# Altium schematic sheet SW8-AcousticsPowerBoard.SchDoc
size A; SheetNumber: 1; SheetTotal: 1
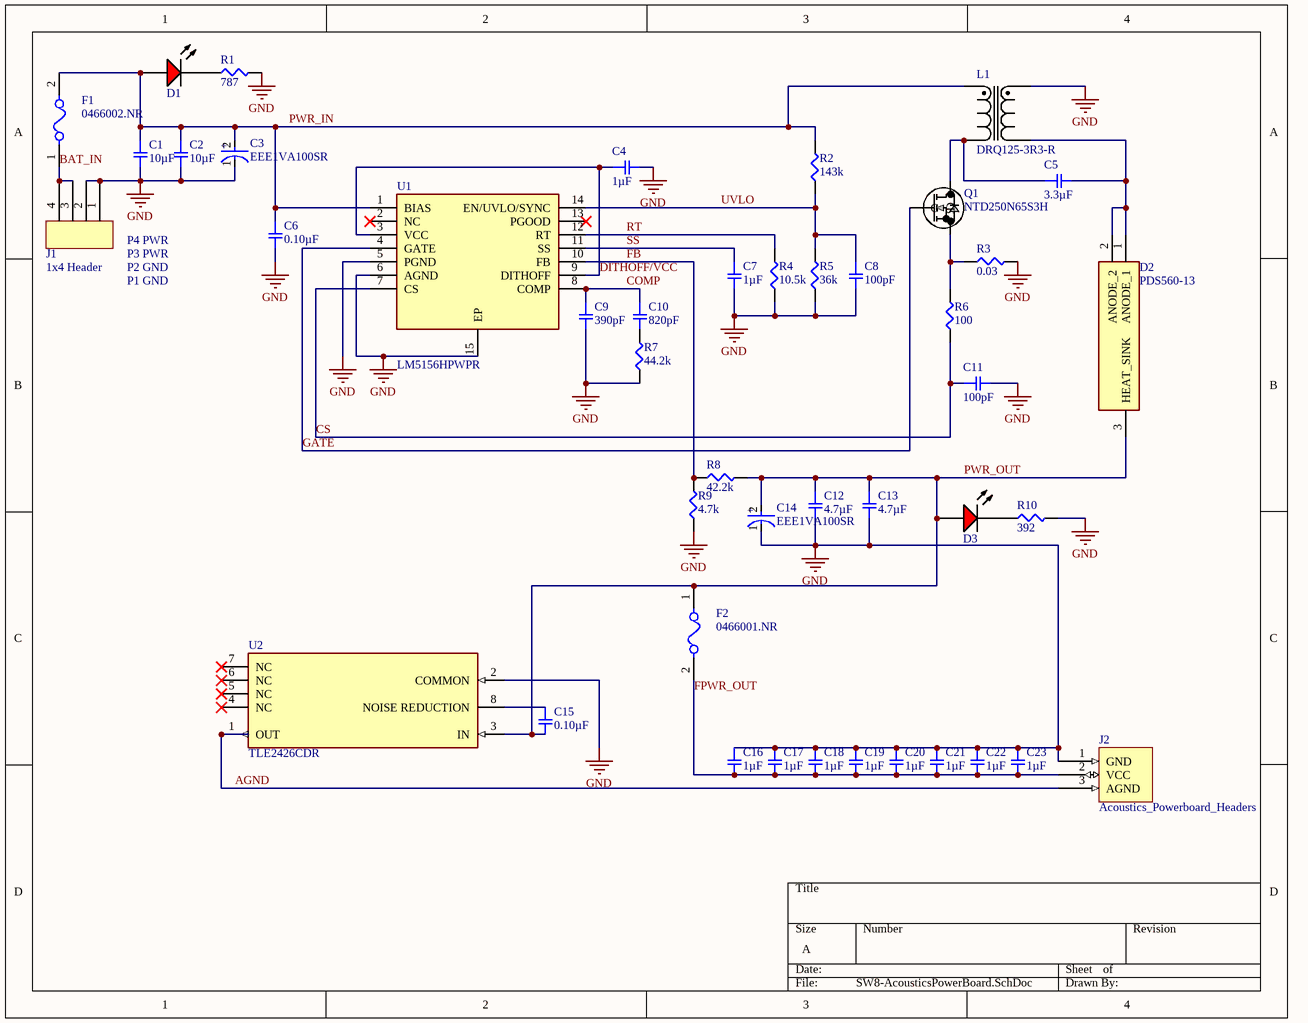
[diagram p0: SW8-AcousticsPowerBoard.SchDoc]

## Parts
C1  10µF  [SMD-0805C]
C2  10µF  [SMD-0805C]
C3  EEE1VA100SR  [FP-SC-MFG]
C4  1µF  [SMD-0805C]
C5  3.3µF  [SMD-0805C]
C6  0.10µF  [SMD-0805C]
C7  1µF  [SMD-0805C]
C8  100pF  [SMD-0805C]
C9  390pF  [SMD-0805C]
C10  820pF  [SMD-0805C]
C11  100pF  [SMD-0805C]
C12  4.7µF  [SMD-0805C]
C13  4.7µF  [SMD-0805C]
C14  EEE1VA100SR  [FP-SC-MFG]
C15  0.10µF  [SMD-0805C]
C16  1µF  [SMD-0805C]
C17  1µF  [SMD-0805C]
C18  1µF  [SMD-0805C]
C19  1µF  [SMD-0805C]
C20  1µF  [SMD-0805C]
C21  1µF  [SMD-0805C]
C22  1µF  [SMD-0805C]
C23  1µF  [SMD-0805C]
D1  TLMS1100-GS08  [VISH-TLMX1100_V]  (value not drawn)
D2  PDS560-13  [POWERDI5]
D3  TLMS1100-GS08  [VISH-TLMX1100_V]  (value not drawn)
F1  0466002.NR  [FP-0466-MFG]
F2  0466001.NR  [FP-0466-MFG]
J1  1x4 Header  [1X4 HEADER]
J2  Acoustics_Powerboard_Headers  [Acoustics_Powerboard_Headers]
L1  DRQ125-3R3-R  [DRQ125]
Q1  NTD250N65S3H  [TO252_NTD250_ONS]
R1  787  [SMD-0805-RES]
R2  143k  [SMD-0805-RES]
R3  0.03  [SMD-0805-RES]
R4  10.5k  [SMD-0805-RES]
R5  36k  [SMD-0805-RES]
R6  100  [SMD-0805-RES]
R7  44.2k  [SMD-0805-RES]
R8  42.2k  [SMD-0805-RES]
R9  4.7k  [SMD-0805-RES]
R10  392  [SMD-0805-RES]
U1  LM5156HPWPR  [SOP65P640X120-15N]
U2  TLE2426CDR  [FP-D0008A-IPC_B]

## Nets
GND: C1.2 C2.2 C3.1(C) C4.2 C6.2 C7.2 C8.2 C9.2 C11.2 C12.2 C13.2 C14.1(C) C16.1 C17.1 C18.1 C19.1 C20.1 C21.1 C22.1 C23.1 J1.1 J1.2 J2.1(GND) L1.2 R1.2 R3.2 R4.1 R5.1 R7.1 R9.1 R10.2 U1.5(PGND) U1.6(AGND) U1.15(EP) U2.2(COMMON)
AGND: J2.3(AGND) U2.1(OUT)
BAT_IN: F1.1 J1.3 J1.4
COMP: C9.1 C10.1 U1.8(COMP)
CS: C11.1 R6.1 U1.7(CS)
DITHOFF/VCC: C4.1 U1.3(VCC) U1.9(DITHOFF)
FB: R8.1 R9.2 U1.10(FB)
FPWR_OUT: C16.2 C17.2 C18.2 C19.2 C20.2 C21.2 C22.2 C23.2 F2.2 J2.2(VCC)
GATE: Q1.1(G) U1.4(GATE)
PWR_IN: C1.1 C2.1 C3.2(A) C6.1 D1.1(A) F1.2 L1.1 R2.2 U1.1(BIAS)
PWR_OUT: C12.1 C13.1 C14.2(A) C15.2 D2.3(HEAT_SINK) D3.1(A) F2.1 R8.2 U2.3(IN)
RT: R4.2 U1.12(RT)
SS: C7.1 U1.11(SS)
UVLO: C8.1 R2.1 R5.2 U1.14(EN/UVLO/SYNC)
NetC5_1: C5.1 L1.3 Q1.2(D)
NetC5_2: C5.2 D2.1(ANODE_1) D2.2(ANODE_2) L1.4
NetC10_2: C10.2 R7.2
NetC15_1: C15.1 U2.8(NOISE_REDUCTION)
NetD1_2: D1.2(K) R1.1
NetD3_2: D3.2(K) R10.1
NetQ1_3: Q1.3(S) R3.1 R6.2

Not connected (* = marked no-connect by the designer): U1 2(NC)* 13(PGOOD)*; U2 4(NC)* 5(NC)* 6(NC)* 7(NC)*

## Notes on the sheet
- (near J1) P4 PWR
- (near J1) P3 PWR
- (near J1) P2 GND
- P1 GND
- (in symbol CMP-05427-000087-1) +

## Library data of the parts
C1 C2 = GRM219R61E106KA12D: CAP CER 10UF 25V X5R 0805; Manufacturer: Murata Electronics North America; Factory Stock: 0; Unit Price (USD): 0.24; Minimum Quantity: 1; Tolerance: ±10%; Datasheets: http://www.murata.com/~/media/webrenewal/support/library/catalog/products/capacitor/mlcc/c02e.pdf; Image: //media.digikey.com/Renders/Murata%20Renders/0805%20(2012%20Metric)%20.85mm.jpg; Digi-Key Part Number: 490-7207-1-ND; Part Number: GRM219R61E106KA12D; Quantity Available: 109571; @ qty: 0; Packaging: Cut Tape (CT); Series: GRM; Part Status: Active; Value: 10µF; Voltage: 25V; Temperature Coefficient: X5R; Operating Temperature: -55°C ~ 85°C; Features: Derating Recommended; Ratings: -; Applications: General Purpose; Mounting Type: Surface Mount, MLCC; Package / Case: 0805 (2012 Metric); Size / Dimension: 0.079" L x 0.049" W (2.01mm x 1.25mm); Height - Seated (Max): -; Thickness (Max): 0.037" (0.95mm); Lead Spacing: -; Lead Style: -
C3 C14 = CMP-05427-000087-1: CAP ALUM 10UF 20% 35V SMD; Life (Hours): 2000Hour; Lead Length: 2.2mm; Ripple Current (AC): 30mA; Leakage Current: 3uA; Length: 5.5mm; Construction: Cylindrical; Diameter: 5mm; RoHS Compliant: Yes; REACH SVHC: No SVHC; Capacitance: 10uF; Max Operating Temperature: 85°C; Series: S; Case/Package: Radial; Contact Plating: Tin; Packaging: Tape and Reel; Voltage Rating: 35V; Number of Pins: 2; Height: 5.4mm; Width: 5.3mm; Voltage Rating (DC): 35V; Mount: Surface Mount; Tolerance: 20%; Lead Pitch: 1.5mm; Radiation Hardening: No; Height - Seated (Max): 0.213inch; Ripple Current: 30mA; Voltage: 35V; Package Quantity: 1; Termination: SMD/SMT; Min Operating Temperature: -40°C
C4 C7 = GCJ21BR71E105KA12L: CAP CER 1UF 25V X7R 0805; Manufacturer: Murata Electronics North America; Factory Stock: 0; Unit Price (USD): 0.36; Minimum Quantity: 1; Tolerance: ±10%; Datasheets: http://www.murata.com/~/media/webrenewal/support/library/catalog/products/capacitor/mlcc/c03e.ashx; Image: //media.digikey.com/Renders/Murata%20Renders/0805%20(2012%20Metric)%20.85mm.jpg; Digi-Key Part Number: 490-5802-1-ND; Part Number: GCJ21BR71E105KA12L; Quantity Available: 15950; @ qty: 0; Packaging: Cut Tape (CT); Series: GCJ; Part Status: Active; Value: 1µF; Voltage: 25V; Temperature Coefficient: X7R; Operating Temperature: -55°C ~ 125°C; Features: Soft Termination; Ratings: AEC-Q200; Applications: Automotive, Boardflex Sensitive; Mounting Type: Surface Mount, MLCC; Package / Case: 0805 (2012 Metric); Size / Dimension: 0.079" L x 0.049" W (2.00mm x 1.25mm); Height - Seated (Max): -; Thickness (Max): 0.057" (1.45mm); Lead Spacing: -; Lead Style: -
C5 = GRM21BR61E335KA12L: CAP CER 3.3UF 25V X5R 0805; Manufacturer: Murata Electronics North America; Factory Stock: 0; Unit Price (USD): 0.42; Minimum Quantity: 1; Tolerance: ±10%; Datasheets: http://www.murata.com/~/media/webrenewal/support/library/catalog/products/capacitor/mlcc/c02e.pdf; Image: //media.digikey.com/Renders/Murata%20Renders/0805%20(2012%20Metric)%20.85mm.jpg; Digi-Key Part Number: 490-8313-1-ND; Part Number: GRM21BR61E335KA12L; Quantity Available: 9547; @ qty: 0; Packaging: Cut Tape (CT); Series: GRM; Part Status: Active; Value: 3.3µF; Voltage: 25V; Temperature Coefficient: X5R; Operating Temperature: -55°C ~ 85°C; Features: -; Ratings: -; Applications: General Purpose; Mounting Type: Surface Mount, MLCC; Package / Case: 0805 (2012 Metric); Size / Dimension: 0.079" L x 0.049" W (2.00mm x 1.25mm); Height - Seated (Max): -; Thickness (Max): 0.053" (1.35mm); Lead Spacing: -; Lead Style: -
C6 C15 = GCD21BR71H104KA01L: CAP CER 0.1UF 50V X7R 0805; Manufacturer: Murata Electronics North America; Factory Stock: 0; Unit Price (USD): 0.24; Minimum Quantity: 1; Tolerance: ±10%; Datasheets: http://www.murata.com/~/media/webrenewal/support/library/catalog/products/capacitor/mlcc/c03e.ashx; Image: //media.digikey.com/Renders/Murata%20Renders/0805%28GxM6%29.jpg; Digi-Key Part Number: 490-11955-1-ND; Part Number: GCD21BR71H104KA01L; Quantity Available: 157; @ qty: 0; Packaging: Cut Tape (CT); Series: GCD; Part Status: Active; Value: 0.10µF; Voltage: 50V; Temperature Coefficient: X7R; Operating Temperature: -55°C ~ 125°C; Features: -; Ratings: AEC-Q200; Applications: Automotive; Mounting Type: Surface Mount, MLCC; Package / Case: 0805 (2012 Metric); Size / Dimension: 0.079" L x 0.049" W (2.00mm x 1.25mm); Height - Seated (Max): -; Thickness (Max): 0.049" (1.25mm); Lead Spacing: -; Lead Style: -
C8 C11 = GCM2165C1H101JA16D: CAP CER 100PF 50V NP0 0805; Manufacturer: Murata Electronics North America; Factory Stock: 0; Unit Price (USD): 0.13; Minimum Quantity: 1; Tolerance: ±5%; Temperature Coefficient: C0G, NP0; Datasheets: http://www.murata.com/~/media/webrenewal/support/library/catalog/products/capacitor/mlcc/c03e.ashx; Image: //media.digikey.com/Renders/Murata%20Renders/0805%28GxM6%29.jpg; Digi-Key Part Number: 490-8031-1-ND; Part Number: GCM2165C1H101JA16D; Quantity Available: 42017; @ qty: 0; Packaging: Cut Tape (CT); Series: GCM; Part Status: Active; Value: 100pF; Voltage: 50V; Operating Temperature: -55°C ~ 125°C; Features: -; Ratings: AEC-Q200; Applications: Automotive; Mounting Type: Surface Mount, MLCC; Package / Case: 0805 (2012 Metric); Size / Dimension: 0.079" L x 0.049" W (2.00mm x 1.25mm); Height - Seated (Max): -; Thickness (Max): 0.028" (0.70mm); Lead Spacing: -; Lead Style: -
C9 = GRM2165C1H391JA01D: CAP CER 390PF 50V NP0 0805; Manufacturer: Murata Electronics North America; Factory Stock: 0; Unit Price (USD): 0.19; Minimum Quantity: 1; Tolerance: ±5%; Temperature Coefficient: C0G, NP0; Datasheets: http://www.murata.com/~/media/webrenewal/support/library/catalog/products/capacitor/mlcc/c02e.pdf; Image: //media.digikey.com/Renders/Murata%20Renders/0805%20(2012%20Metric)%20.85mm.jpg; Digi-Key Part Number: 490-11547-1-ND; Part Number: GRM2165C1H391JA01D; Quantity Available: 7599; @ qty: 0; Packaging: Cut Tape (CT); Series: GRM; Part Status: Active; Value: 390pF; Voltage: 50V; Operating Temperature: -55°C ~ 125°C; Features: -; Ratings: -; Applications: General Purpose; Mounting Type: Surface Mount, MLCC; Package / Case: 0805 (2012 Metric); Size / Dimension: 0.079" L x 0.049" W (2.00mm x 1.25mm); Height - Seated (Max): -; Thickness (Max): 0.028" (0.70mm); Lead Spacing: -; Lead Style: -
C10 = GRM2165C1H821JA01D: CAP CER 820PF 50V NP0 0805; Manufacturer: Murata Electronics North America; Factory Stock: 0; Unit Price (USD): 0.21; Minimum Quantity: 1; Tolerance: ±5%; Temperature Coefficient: C0G, NP0; Datasheets: http://www.murata.com/~/media/webrenewal/support/library/catalog/products/capacitor/mlcc/c02e.pdf; Image: //media.digikey.com/Renders/Murata%20Renders/0805%20(2012%20Metric)%20.85mm.jpg; Digi-Key Part Number: 490-11551-1-ND; Part Number: GRM2165C1H821JA01D; Quantity Available: 17274; @ qty: 0; Packaging: Cut Tape (CT); Series: GRM; Part Status: Active; Value: 820pF; Voltage: 50V; Operating Temperature: -55°C ~ 125°C; Features: -; Ratings: -; Applications: General Purpose; Mounting Type: Surface Mount, MLCC; Package / Case: 0805 (2012 Metric); Size / Dimension: 0.079" L x 0.049" W (2.00mm x 1.25mm); Height - Seated (Max): -; Thickness (Max): 0.028" (0.70mm); Lead Spacing: -; Lead Style: -
C12 C13 = GRM21BC71H475KE11L: CAP CER 4.7UF 50V X7S 0805; Manufacturer: Murata Electronics North America; Factory Stock: 0; Unit Price (USD): 0.47; Minimum Quantity: 1; Tolerance: ±10%; Datasheets: http://www.murata.com/~/media/webrenewal/support/library/catalog/products/capacitor/mlcc/c02e.pdf; Image: //media.digikey.com/Renders/Murata%20Renders/0805%20(2012%20Metric)%20.85mm.jpg; Digi-Key Part Number: 490-12757-1-ND; Part Number: GRM21BC71H475KE11L; Quantity Available: 6797; @ qty: 0; Packaging: Cut Tape (CT); Series: GRM; Part Status: Active; Value: 4.7µF; Voltage: 50V; Temperature Coefficient: X7S; Operating Temperature: -55°C ~ 125°C; Features: -; Ratings: -; Applications: General Purpose; Mounting Type: Surface Mount, MLCC; Package / Case: 0805 (2012 Metric); Size / Dimension: 0.079" L x 0.049" W (2.00mm x 1.25mm); Height - Seated (Max): -; Thickness (Max): 0.057" (1.45mm); Lead Spacing: -; Lead Style: -
C16-C23 = GCJ21BR71H105KA01L: CAP CER 1UF 50V X7R 0805; Manufacturer: Murata Electronics North America; Factory Stock: 0; Unit Price (USD): 0.33; Minimum Quantity: 1; Tolerance: ±10%; Datasheets: http://www.murata.com/~/media/webrenewal/support/library/catalog/products/capacitor/mlcc/c03e.ashx; Image: //media.digikey.com/Renders/Murata%20Renders/0805%20(2012%20Metric)%20.85mm.jpg; Digi-Key Part Number: 490-10667-1-ND; Part Number: GCJ21BR71H105KA01L; Quantity Available: 55137; @ qty: 0; Packaging: Cut Tape (CT); Series: GCJ; Part Status: Active; Value: 1µF; Voltage: 50V; Temperature Coefficient: X7R; Operating Temperature: -55°C ~ 125°C; Features: Soft Termination; Ratings: AEC-Q200; Applications: Automotive, Boardflex Sensitive; Mounting Type: Surface Mount, MLCC; Package / Case: 0805 (2012 Metric); Size / Dimension: 0.079" L x 0.049" W (2.00mm x 1.25mm); Height - Seated (Max): -; Thickness (Max): 0.057" (1.45mm); Lead Spacing: -; Lead Style: -
D1 D3 = CMP-1666-00027-1: LED, RED, 2.1 V, -40 to 100 degC, 2-Pin SMD (0603), RoHS, Tape and Reel; Manufacturer: Wurth Elektronics; Manufacturer Part Number: 150080SS75000; Value: 1.9V; Datasheet Link: https://www.mouser.com/ProductDetail/Wurth-Elektronik/150080SS75000?qs=LlUlMxKIyB2zzpiaOzrUdw%3D%3D&mgh=1&gclid=Cj0KCQjwm6KUBhC3ARIsACIwxBhChbj4MsdASq_HKZ9IIHp_SBsI6cWeNQVHWnPWPX4ZaUjtoXFUdFUaAm30EALw_wcB; Operating Temperature: -40to85degC; Package / Case: 0805 (2012 Metric); RoHS: Pb-Free
D2 = PDS560-13: Diode; Manufacturer_Name: Diodes Inc.; Manufacturer_Part_Number: PDS560-13
F1 = CMP-2000-05742-2: FUSE BOARD MNT 2A 63VAC/VDC 1206; Manufacturer: Littelfuse; Max Fuse Dc Voltage: 63V; Fuse I2T: 0.2326A2Sec; Fuse Voltage Drop: 78.73mV; Fuse Interrupt Ac Current: 50A; Resistance: 0.03Ω; Value: 0.03Ω; Fuse Blow Speed: Fast; Temperature Range Low: -55°C; Octopart: https://octopart.com/0466002.nr-littelfuse-566006; Category: Fuse; Digikey Description: FUSE BOARD MNT 2A 63VAC/VDC 1206; Height: 0.66mm; Temperature: -55°C to +90°C; ComponentLink2URL: https://www.littelfuse.com/~/media/electronics/datasheets/fuses/littelfuse_fuse_466_datasheet.pdf.pdf; Device Class L3: unset; Device Class L2: Fuses; Device Class L1: Circuit Protection; Lead Free: Yes; Mouser Description: 466 Series Very Fast-Acting 63 V 2 A 1206 Surface Mount Thin Film Fuse; Package: 0466; Fuse Current: 2A; Temperature Range High: +90°C; Voltage Rating: 63V; Manufacturer Part Number: 0466002.NR; Automotive: No; Max Fuse Ac Voltage: 63V; ComponentLink2Description: Datasheet; RoHS: TRUE; Fuse Interrupt Dc Current: 50A
F2 = CMP-08605-000058-1: FUSE BOARD MNT 1A 63VAC/VDC 1206; Manufacturer: Littelfuse Inc; Max Fuse Dc Voltage: 63V; Fuse Interrupt Ac Current: 50A; Fuse Voltage Drop: 79.97mV; Resistance: 0.075Ω; Value: 0.075Ω; Fuse I2T: 0.0423A2Sec; Fuse Blow Speed: Fast; Temperature Range High: +90°C; Max Fuse Ac Voltage: 63V; Manufacturer Part Number: 0466001.NR; Package: 0466; ComponentLink2URL: https://www.littelfuse.com/~/media/electronics/datasheets/fuses/littelfuse_fuse_466_datasheet.pdf.pdf; Device Class L3: unset; Lead Free: Yes; Automotive: No; Digikey Description: FUSE BOARD MNT 1A 63VAC/VDC 1206; Height: 0.66mm; Temperature Range Low: -55°C; Category: Fuse; ComponentLink2Description: Datasheet; Device Class L1: Circuit Protection; Device Class L2: Fuses; Fuse Current: 1A; Mouser Description: Surface Mount Fuses 63V FA 1206 1A VFA Slimline; Octopart: https://octopart.com/0466001.nr-littelfuse-566005; Fuse Interrupt Dc Current: 50A; RoHS: TRUE; Voltage Rating: 63V; Temperature: -55°C to +90°C
J1 = 1X4 Header: CONN HEADER VERT 4POS 2.54MM; Manufacturer: Würth Elektronik; Manufacturer Part Number: 61300411121; Value: 1x4 Header
L1 = DRQ125-3R3-R: Shielded 2 Coil Inductor Array 12.34 µH Inductance - Connected in Series 3.084 µH Inductance - Connected in Parallel 6.3mOhm DC Resistance (DCR) - Parallel 9.26 A Nonstandard; Mfr_Name: Eaton; Type: DEV; Copyright: Copyright (C) 2022 Ultra Librarian. All rights reserved.; Manufacturer_Part_Number: DRQ125-3R3-R; Digi-Key_Part_Number_1: 513-1285-1-ND; Digi-Key_Part_Number_2: 513-1285-2-ND; Digi-Key_Part_Number_3: 513-1285-6-ND; RefDes: RefDes
Q1 = NTD250N65S3H: No Description Available; Mfr_Name: onsemi; Type: DEV; Copyright: Copyright (C) 2022 Ultra Librarian. All rights reserved.; Manufacturer_Part_Number: NTD250N65S3H; Digi-Key_Part_Number_1: 488-NTD250N65S3HTR-ND; Digi-Key_Part_Number_2: 488-NTD250N65S3HCT-ND; Digi-Key_Part_Number_3: 488-NTD250N65S3HDKR-ND; RefDes: RefDes
R1 = ERJ-6ENF7870V: RES SMD 787 OHM 1% 1/8W 0805; Manufacturer: Panasonic Electronic Components; Factory Stock: 0; Unit Price (USD): 0.00729; @ qty: 1500; Minimum Quantity: 1; Power (Watts): 0.125W, 1/8W; Temperature Coefficient: ±100ppm/°C; Part Number: ERJ-6ENF7870V; Datasheets: http://industrial.panasonic.com/www-cgi/jvcr13pz.cgi?E+PZ+3+AOA0002+ERJ6ENF7870V+7+WW; Image: //media.digikey.com/Renders/Panasonic%20Renders/ERJ-0805%20Pkg.jpg; Digi-Key Part Number: P787CCT-ND; Quantity Available: 32899; Packaging: Cut Tape (CT); Series: ERJ; Part Status: Active; Value: 787; Tolerance: ±1%; Composition: Thick Film; Features: Automotive AEC-Q200; Operating Temperature: -55°C ~ 155°C; Package / Case: 0805 (2012 Metric); Supplier Device Package: 0805; Size / Dimension: 0.079" L x 0.049" W (2.00mm x 1.25mm); Height - Seated (Max): 0.028" (0.70mm); Number of Terminations: 2; Failure Rate: -
R2 = ERJ-6ENF1433V: RES SMD 143K OHM 1% 1/8W 0805; Manufacturer: Panasonic Electronic Components; Factory Stock: 0; Unit Price (USD): 0.00729; @ qty: 1500; Minimum Quantity: 1; Power (Watts): 0.125W, 1/8W; Temperature Coefficient: ±100ppm/°C; Part Number: ERJ-6ENF1433V; Datasheets: http://industrial.panasonic.com/www-cgi/jvcr13pz.cgi?E+PZ+3+AOA0002+ERJ6ENF1433V+7+WW; Image: //media.digikey.com/Renders/Panasonic%20Renders/ERJ-0805%20Pkg.jpg; Digi-Key Part Number: P143KCCT-ND; Quantity Available: 35953; Packaging: Cut Tape (CT); Series: ERJ; Part Status: Active; Value: 143k; Tolerance: ±1%; Composition: Thick Film; Features: Automotive AEC-Q200; Operating Temperature: -55°C ~ 155°C; Package / Case: 0805 (2012 Metric); Supplier Device Package: 0805; Size / Dimension: 0.079" L x 0.049" W (2.00mm x 1.25mm); Height - Seated (Max): 0.028" (0.70mm); Number of Terminations: 2; Failure Rate: -
R3 = ERJ-6BWFR030V: RES SMD 0.03 OHM 1% 1/2W 0805; Manufacturer: Panasonic Electronic Components; Factory Stock: 0; Unit Price (USD): 0.16031; @ qty: 1500; Minimum Quantity: 1; Power (Watts): 0.5W, 1/2W; Temperature Coefficient: ±200ppm/°C; Part Number: ERJ-6BWFR030V; Datasheets: https://industrial.panasonic.com/cdbs/www-data/pdf/RDA0000/AOA0000C239.pdf; Image: //media.digikey.com/Renders/Panasonic%20Renders/ERJ-0805%20Pkg.jpg; Digi-Key Part Number: P.03AQCT-ND; Quantity Available: 20255; Packaging: Cut Tape (CT); Series: ERJ; Part Status: Active; Value: 0.03; Tolerance: ±1%; Composition: Thick Film; Features: Automotive AEC-Q200, Current Sense; Operating Temperature: -55°C ~ 155°C; Package / Case: 0805 (2012 Metric); Supplier Device Package: 0805; Size / Dimension: 0.079" L x 0.049" W (2.00mm x 1.25mm); Height - Seated (Max): 0.030" (0.75mm); Number of Terminations: 2; Failure Rate: -
R4 = ERJ-6ENF1052V: RES SMD 10.5K OHM 1% 1/8W 0805; Manufacturer: Panasonic Electronic Components; Factory Stock: 0; Unit Price (USD): 0.00729; @ qty: 1500; Minimum Quantity: 1; Power (Watts): 0.125W, 1/8W; Temperature Coefficient: ±100ppm/°C; Part Number: ERJ-6ENF1052V; Datasheets: http://industrial.panasonic.com/www-cgi/jvcr13pz.cgi?E+PZ+3+AOA0002+ERJ6ENF1052V+7+WW; Image: //media.digikey.com/Renders/Panasonic%20Renders/ERJ-0805%20Pkg.jpg; Digi-Key Part Number: P10.5KCCT-ND; Quantity Available: 20335; Packaging: Cut Tape (CT); Series: ERJ; Part Status: Active; Value: 10.5k; Tolerance: ±1%; Composition: Thick Film; Features: Automotive AEC-Q200; Operating Temperature: -55°C ~ 155°C; Package / Case: 0805 (2012 Metric); Supplier Device Package: 0805; Size / Dimension: 0.079" L x 0.049" W (2.00mm x 1.25mm); Height - Seated (Max): 0.028" (0.70mm); Number of Terminations: 2; Failure Rate: -
R5 = ERJ-6ENF3602V: RES SMD 36K OHM 1% 1/8W 0805; Manufacturer: Panasonic Electronic Components; Factory Stock: 0; Unit Price (USD): 0.00729; @ qty: 1500; Minimum Quantity: 1; Power (Watts): 0.125W, 1/8W; Temperature Coefficient: ±100ppm/°C; Part Number: ERJ-6ENF3602V; Datasheets: http://industrial.panasonic.com/www-cgi/jvcr13pz.cgi?E+PZ+3+AOA0002+ERJ6ENF3602V+7+WW; Image: //media.digikey.com/Renders/Panasonic%20Renders/ERJ-0805%20Pkg.jpg; Digi-Key Part Number: P36.0KCCT-ND; Quantity Available: 42552; Packaging: Cut Tape (CT); Series: ERJ; Part Status: Active; Value: 36k; Tolerance: ±1%; Composition: Thick Film; Features: Automotive AEC-Q200; Operating Temperature: -55°C ~ 155°C; Package / Case: 0805 (2012 Metric); Supplier Device Package: 0805; Size / Dimension: 0.079" L x 0.049" W (2.00mm x 1.25mm); Height - Seated (Max): 0.028" (0.70mm); Number of Terminations: 2; Failure Rate: -
R6 = ERJ-6ENF1000V: RES SMD 100 OHM 1% 1/8W 0805; Manufacturer: Panasonic Electronic Components; Factory Stock: 0; Unit Price (USD): 0.00729; @ qty: 1500; Minimum Quantity: 1; Power (Watts): 0.125W, 1/8W; Temperature Coefficient: ±100ppm/°C; Part Number: ERJ-6ENF1000V; Datasheets: http://industrial.panasonic.com/www-cgi/jvcr13pz.cgi?E+PZ+3+AOA0002+ERJ6ENF1000V+7+WW; Image: //media.digikey.com/Renders/Panasonic%20Renders/ERJ-0805%20Pkg.jpg; Digi-Key Part Number: P100CCT-ND; Quantity Available: 288663; Packaging: Cut Tape (CT); Series: ERJ; Part Status: Active; Value: 100; Tolerance: ±1%; Composition: Thick Film; Features: Automotive AEC-Q200; Operating Temperature: -55°C ~ 155°C; Package / Case: 0805 (2012 Metric); Supplier Device Package: 0805; Size / Dimension: 0.079" L x 0.049" W (2.00mm x 1.25mm); Height - Seated (Max): 0.028" (0.70mm); Number of Terminations: 2; Failure Rate: -
R7 = ERJ-6ENF4422V: RES SMD 44.2K OHM 1% 1/8W 0805; Manufacturer: Panasonic Electronic Components; Factory Stock: 0; Unit Price (USD): 0.00729; @ qty: 1500; Minimum Quantity: 1; Power (Watts): 0.125W, 1/8W; Temperature Coefficient: ±100ppm/°C; Part Number: ERJ-6ENF4422V; Datasheets: http://industrial.panasonic.com/www-cgi/jvcr13pz.cgi?E+PZ+3+AOA0002+ERJ6ENF4422V+7+WW; Image: //media.digikey.com/Renders/Panasonic%20Renders/ERJ-0805%20Pkg.jpg; Digi-Key Part Number: P44.2KCCT-ND; Quantity Available: 47343; Packaging: Cut Tape (CT); Series: ERJ; Part Status: Active; Value: 44.2k; Tolerance: ±1%; Composition: Thick Film; Features: Automotive AEC-Q200; Operating Temperature: -55°C ~ 155°C; Package / Case: 0805 (2012 Metric); Supplier Device Package: 0805; Size / Dimension: 0.079" L x 0.049" W (2.00mm x 1.25mm); Height - Seated (Max): 0.028" (0.70mm); Number of Terminations: 2; Failure Rate: -
R8 = ERJ-6ENF4222V: RES SMD 42.2K OHM 1% 1/8W 0805; Manufacturer: Panasonic Electronic Components; Factory Stock: 0; Unit Price (USD): 0.00729; @ qty: 1500; Minimum Quantity: 1; Power (Watts): 0.125W, 1/8W; Temperature Coefficient: ±100ppm/°C; Part Number: ERJ-6ENF4222V; Datasheets: http://industrial.panasonic.com/www-cgi/jvcr13pz.cgi?E+PZ+3+AOA0002+ERJ6ENF4222V+7+WW; Image: //media.digikey.com/Renders/Panasonic%20Renders/ERJ-0805%20Pkg.jpg; Digi-Key Part Number: P42.2KCCT-ND; Quantity Available: 30408; Packaging: Cut Tape (CT); Series: ERJ; Part Status: Active; Value: 42.2k; Tolerance: ±1%; Composition: Thick Film; Features: Automotive AEC-Q200; Operating Temperature: -55°C ~ 155°C; Package / Case: 0805 (2012 Metric); Supplier Device Package: 0805; Size / Dimension: 0.079" L x 0.049" W (2.00mm x 1.25mm); Height - Seated (Max): 0.028" (0.70mm); Number of Terminations: 2; Failure Rate: -
R9 = ERJ-6ENF4701V: RES SMD 4.7K OHM 1% 1/8W 0805; Manufacturer: Panasonic Electronic Components; Factory Stock: 0; Unit Price (USD): 0.00729; @ qty: 1500; Minimum Quantity: 1; Power (Watts): 0.125W, 1/8W; Temperature Coefficient: ±100ppm/°C; Part Number: ERJ-6ENF4701V; Datasheets: http://industrial.panasonic.com/www-cgi/jvcr13pz.cgi?E+PZ+3+AOA0002+ERJ6ENF4701V+7+WW; Image: //media.digikey.com/Renders/Panasonic%20Renders/ERJ-0805%20Pkg.jpg; Digi-Key Part Number: P4.70KCCT-ND; Quantity Available: 312387; Packaging: Cut Tape (CT); Series: ERJ; Part Status: Active; Value: 4.7k; Tolerance: ±1%; Composition: Thick Film; Features: Automotive AEC-Q200; Operating Temperature: -55°C ~ 155°C; Package / Case: 0805 (2012 Metric); Supplier Device Package: 0805; Size / Dimension: 0.079" L x 0.049" W (2.00mm x 1.25mm); Height - Seated (Max): 0.028" (0.70mm); Number of Terminations: 2; Failure Rate: -
R10 = ERJ-6ENF3920V: RES SMD 392 OHM 1% 1/8W 0805; Manufacturer: Panasonic Electronic Components; Factory Stock: 0; Unit Price (USD): 0.00729; @ qty: 1500; Minimum Quantity: 1; Power (Watts): 0.125W, 1/8W; Temperature Coefficient: ±100ppm/°C; Part Number: ERJ-6ENF3920V; Datasheets: http://industrial.panasonic.com/www-cgi/jvcr13pz.cgi?E+PZ+3+AOA0002+ERJ6ENF3920V+7+WW; Image: //media.digikey.com/Renders/Panasonic%20Renders/ERJ-0805%20Pkg.jpg; Digi-Key Part Number: P392CCT-ND; Quantity Available: 85711; Packaging: Cut Tape (CT); Series: ERJ; Part Status: Active; Value: 392; Tolerance: ±1%; Composition: Thick Film; Features: Automotive AEC-Q200; Operating Temperature: -55°C ~ 155°C; Package / Case: 0805 (2012 Metric); Supplier Device Package: 0805; Size / Dimension: 0.079" L x 0.049" W (2.00mm x 1.25mm); Height - Seated (Max): 0.028" (0.70mm); Number of Terminations: 2; Failure Rate: -
U1 = LM5156HPWPR: Integrated Circuit; Manufacturer_Name: Texas Instruments; Datasheet Link: https://www.ti.com/lit/gpn/lm5156h?HQS=ti-null-null-sf-df-pf-sep-wwe&DCM=yes; Height: 1.2mm; Manufacturer_Part_Number: LM5156HPWPR
U2 = CMP-04916-000011-1: IC VREF GND REF 20V 1% 8SOIC; Max Input Voltage: 40V; Temperature Coefficient: 35ppm/°C; Reference Type: Ground Reference (Virtual); Operating Supply Current: 400uA; Min Output Voltage: 2V; Max Output Current: 20mA; Output Type: Adjustable; Height: 1.58mm; Mount: Surface Mount; Max Operating Temperature: 125°C; Length: 4.9mm; Case/Package: SOIC; Weight: 0.002677oz; Radiation Hardening: No; REACH SVHC: No SVHC; Max Output Voltage: 20V; Output Voltage: 20V; Output Current: 20mA; Min Operating Temperature: -55°C; Package Quantity: 1; Packaging: Tape and Reel; Number of Pins: 8; Width: 3.91mm; Lead Free: Lead Free; Tolerance: 1%; Reference Voltage: 20V